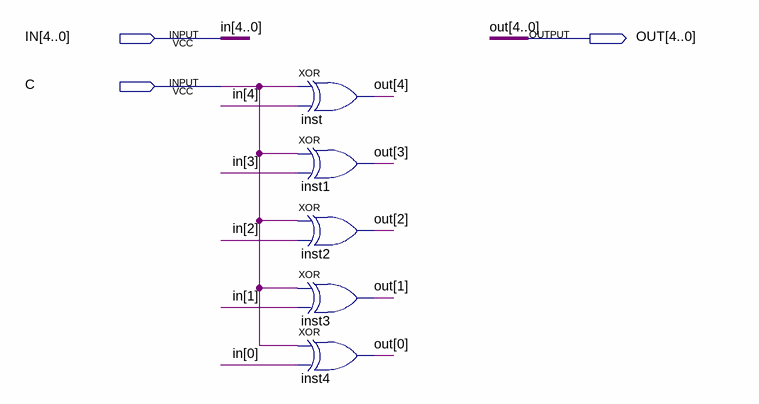
[diagram p0: schematic sheet]
// Quartus schematic Complementa.bdf as structural Verilog: 5 symbols, 3 pins
module Complementa (
  input  [4:0] IN,
  input  C,
  output [4:0] OUT
);

  xor inst (OUT[4], C, IN[4]);
  xor inst1 (OUT[3], C, IN[3]);
  xor inst2 (OUT[2], C, IN[2]);
  xor inst3 (OUT[1], C, IN[1]);
  xor inst4 (OUT[0], C, IN[0]);
endmodule
